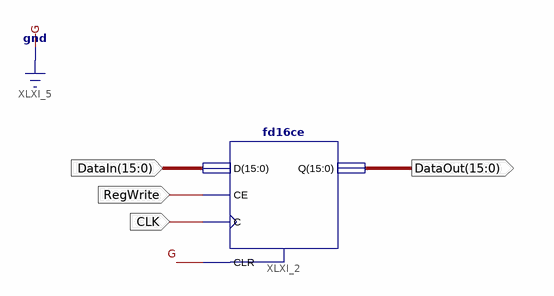
[diagram p0: schematic sheet 1]
// Xilinx ISE schematic Instruction_Register.sch (spartan3e) as structural Verilog: 1 symbols, 4 ports
module Instruction_Register (
  input  [15:0] DataIn,
  input  RegWrite,
  input  CLK,
  output [15:0] DataOut
);

  fd16ce XLXI_2 (.C(CLK), .CE(RegWrite), .CLR(1'b0), .D(DataIn), .Q(DataOut));
endmodule
